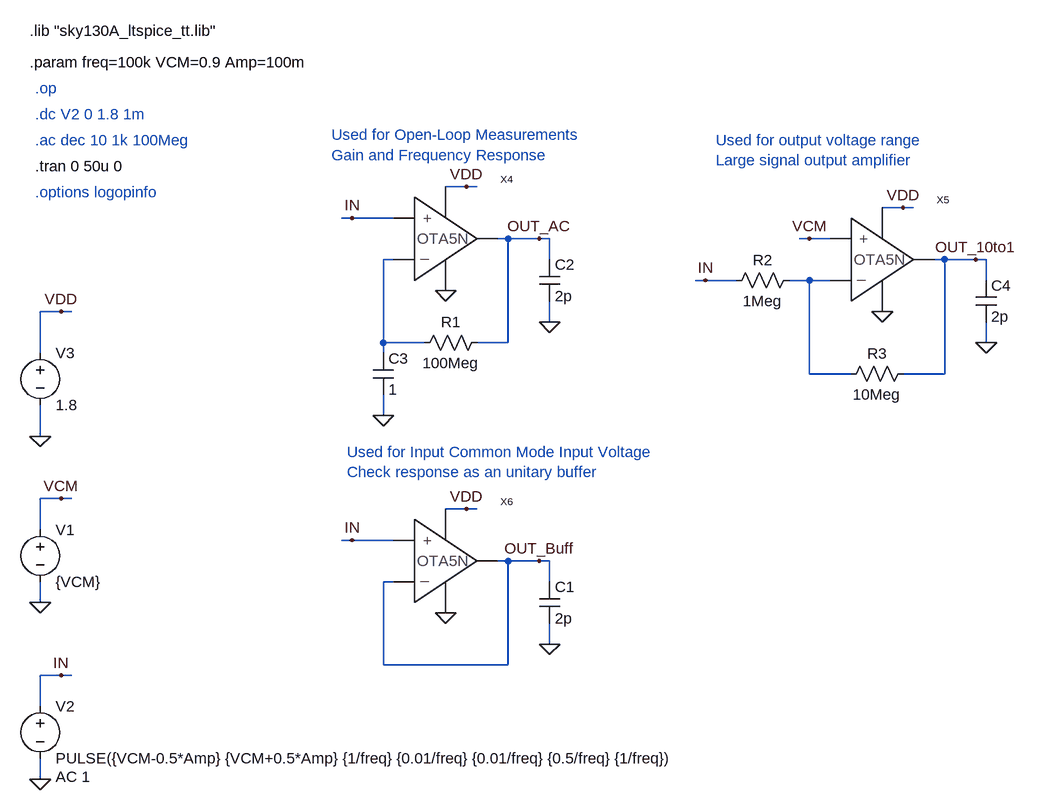
[diagram p0: schematic TB_OTA_Simple.asc]
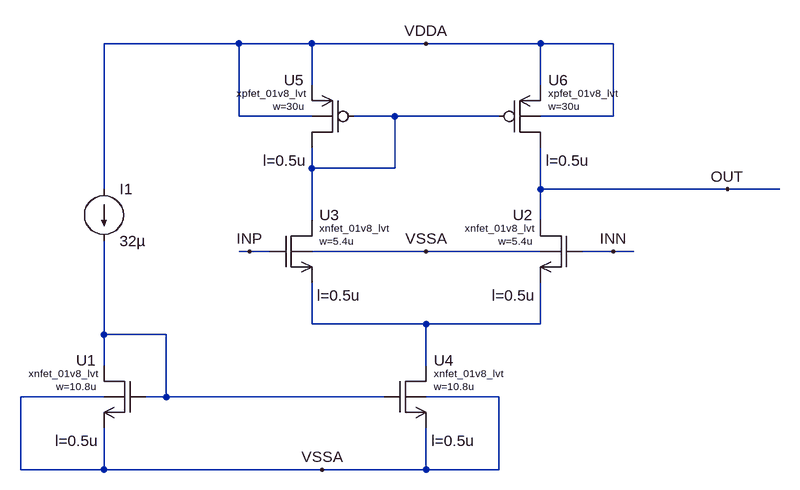
[diagram p1: sub-circuit ota5n_2p_20mhz.asc]
TB_OTA_Simple.asc, the LTspice schematic file:
Version 4.1
SHEET 1 6080 1492
WIRE 800 -224 768 -224
WIRE 816 -224 800 -224
WIRE 1472 -192 1440 -192
WIRE 1488 -192 1472 -192
WIRE 624 -176 608 -176
WIRE 688 -176 624 -176
WIRE 864 -144 848 -144
WIRE 912 -144 864 -144
WIRE 928 -144 912 -144
WIRE 1328 -144 1312 -144
WIRE 1360 -144 1328 -144
WIRE 688 -112 672 -112
WIRE 928 -112 928 -144
WIRE 1536 -112 1520 -112
WIRE 1584 -112 1536 -112
WIRE 1600 -112 1584 -112
WIRE 1168 -80 1152 -80
WIRE 1216 -80 1168 -80
WIRE 1328 -80 1296 -80
WIRE 1360 -80 1328 -80
WIRE 1600 -80 1600 -112
WIRE 176 -32 144 -32
WIRE 192 -32 176 -32
WIRE 928 -16 928 -48
WIRE 672 16 672 -112
WIRE 736 16 672 16
WIRE 864 16 864 -144
WIRE 864 16 816 16
WIRE 1600 16 1600 -16
WIRE 144 32 144 -32
WIRE 672 32 672 16
WIRE 1328 64 1328 -80
WIRE 1392 64 1328 64
WIRE 1536 64 1536 -112
WIRE 1536 64 1472 64
WIRE 672 128 672 96
WIRE 144 160 144 112
WIRE 176 256 144 256
WIRE 192 256 176 256
WIRE 800 272 768 272
WIRE 816 272 800 272
WIRE 144 304 144 256
WIRE 624 320 608 320
WIRE 688 320 624 320
WIRE 864 352 848 352
WIRE 912 352 864 352
WIRE 928 352 912 352
WIRE 688 384 672 384
WIRE 928 384 928 352
WIRE 144 416 144 384
WIRE 928 480 928 448
WIRE 672 512 672 384
WIRE 864 512 864 352
WIRE 864 512 672 512
WIRE 176 528 144 528
WIRE 192 528 176 528
WIRE 144 576 144 528
WIRE 144 688 144 656
FLAG 176 -32 VDD
FLAG 144 160 0
FLAG 144 688 0
FLAG 176 528 IN
FLAG 928 -16 0
FLAG 768 -64 0
FLAG 800 -224 VDD
FLAG 672 128 0
FLAG 624 -176 IN
FLAG 912 -144 OUT_AC
FLAG 928 480 0
FLAG 768 432 0
FLAG 800 272 VDD
FLAG 624 320 IN
FLAG 912 352 OUT_Buff
FLAG 1600 16 0
FLAG 1440 -32 0
FLAG 1472 -192 VDD
FLAG 1584 -112 OUT_10to1
FLAG 144 416 0
FLAG 176 256 VCM
FLAG 1328 -144 VCM
FLAG 1168 -80 IN
SYMBOL voltage 144 16 R0
WINDOW 123 0 0 Left 0
WINDOW 39 0 0 Left 0
SYMATTR InstName V3
SYMATTR Value 1.8
SYMBOL voltage 144 560 R0
WINDOW 123 24 124 Left 2
WINDOW 39 0 0 Left 0
SYMATTR Value2 AC 1
SYMATTR InstName V2
SYMATTR Value PULSE({VCM-0.5*Amp} {VCM+0.5*Amp} {1/freq} {0.01/freq} {0.01/freq} {0.5/freq} {1/freq})
SYMBOL res 832 0 R90
WINDOW 0 0 56 VBottom 2
WINDOW 3 32 56 VTop 2
SYMATTR InstName R1
SYMATTR Value 100Meg
SYMBOL Cap 912 -112 R0
SYMATTR InstName C2
SYMATTR Value 2p
SYMBOL Cap 656 32 R0
SYMATTR InstName C3
SYMATTR Value 1
SYMBOL Cap 912 384 R0
SYMATTR InstName C1
SYMATTR Value 2p
SYMBOL Cap 1584 -80 R0
SYMATTR InstName C4
SYMATTR Value 2p
SYMBOL Res 1312 -96 R90
WINDOW 0 0 56 VBottom 2
WINDOW 3 32 56 VTop 2
SYMATTR InstName R2
SYMATTR Value 1Meg
SYMBOL Res 1488 48 R90
WINDOW 0 0 56 VBottom 2
WINDOW 3 32 56 VTop 2
SYMATTR InstName R3
SYMATTR Value 10Meg
SYMBOL voltage 144 288 R0
WINDOW 123 24 124 Left 2
WINDOW 39 0 0 Left 0
SYMATTR InstName V1
SYMATTR Value {VCM}
SYMBOL OTA5N_2p_20MHz 784 -144 R0
SYMATTR InstName X4
SYMBOL OTA5N_2p_20MHz 1456 -112 R0
SYMATTR InstName X5
SYMBOL OTA5N_2p_20MHz 784 352 R0
SYMATTR InstName X6
TEXT 136 -376 Left 2 ;.op
TEXT 128 -464 Left 2 !.lib "sky130A_ltspice_tt.lib"
TEXT 136 -256 Left 2 !.tran 0 50u 0
TEXT 136 -336 Left 2 ;.dc V2 0 1.8 1m
TEXT 136 -296 Left 2 ;.ac dec 10 1k 100Meg
TEXT 136 -216 Left 2 ;.options logopinfo
TEXT 128 -416 Left 2 !.param freq=100k VCM=0.9 Amp=100m
TEXT 592 -304 Left 2 ;Used for Open-Loop Measurements\nGain and Frequency Response
TEXT 616 184 Left 2 ;Used for Input Common Mode Input Voltage\nCheck response as an unitary buffer
TEXT 1184 -296 Left 2 ;Used for output voltage range\nLarge signal output amplifier

ota5n_2p_20mhz.asc, the sub-circuit schematic file:
Version 4.1
SHEET 1 1108 832
WIRE 144 128 -64 128
WIRE 256 128 144 128
WIRE 432 128 256 128
WIRE 608 128 432 128
WIRE 720 128 608 128
WIRE 256 192 256 128
WIRE 608 192 608 128
WIRE 144 240 144 128
WIRE 256 240 144 240
WIRE 384 240 320 240
WIRE 544 240 384 240
WIRE 720 240 720 128
WIRE 720 240 608 240
WIRE 256 320 256 288
WIRE 384 320 384 240
WIRE 384 320 256 320
WIRE -64 352 -64 128
WIRE 608 352 608 288
WIRE 896 352 608 352
WIRE 976 352 896 352
WIRE 256 400 256 320
WIRE 608 400 608 352
WIRE 160 448 144 448
WIRE 192 448 160 448
WIRE 432 448 256 448
WIRE 608 448 432 448
WIRE 720 448 672 448
WIRE 752 448 720 448
WIRE 256 560 256 496
WIRE 432 560 256 560
WIRE 608 560 608 496
WIRE 608 560 432 560
WIRE -64 576 -64 432
WIRE 32 576 -64 576
WIRE -64 624 -64 576
WIRE 432 624 432 560
WIRE -64 672 -192 672
WIRE 32 672 32 576
WIRE 32 672 0 672
WIRE 368 672 32 672
WIRE 544 672 432 672
WIRE -192 784 -192 672
WIRE -64 784 -64 720
WIRE -64 784 -192 784
WIRE 272 784 -64 784
WIRE 432 784 432 720
WIRE 432 784 272 784
WIRE 544 784 544 672
WIRE 544 784 432 784
FLAG 720 448 INN
FLAG 160 448 INP
FLAG 896 352 OUT
FLAG 432 128 VDDA
FLAG 272 784 VSSA
FLAG 432 448 VSSA
SYMBOL current -64 352 R0
WINDOW 123 0 0 Left 0
WINDOW 39 0 0 Left 0
SYMATTR InstName I1
SYMATTR Value 32µ
SYMBOL xnch -16 624 M0
WINDOW 123 56 116 Left 2
SYMATTR Value2 l=0.5u
SYMATTR InstName U1
SYMATTR Value w=10.8u
SYMATTR SpiceModel xnfet_01v8_lvt
SYMBOL xnch 656 400 M0
WINDOW 123 56 116 Left 2
SYMATTR Value2 l=0.5u
SYMATTR InstName U2
SYMATTR Value w=5.4u
SYMATTR SpiceModel xnfet_01v8_lvt
SYMBOL xnch 208 400 R0
WINDOW 123 56 116 Left 2
SYMATTR Value2 l=0.5u
SYMATTR InstName U3
SYMATTR Value w=5.4u
SYMATTR SpiceModel xnfet_01v8_lvt
SYMBOL xnch 384 624 R0
WINDOW 123 56 116 Left 2
SYMATTR Value2 l=0.5u
SYMATTR InstName U4
SYMATTR Value w=10.8u
SYMATTR SpiceModel xnfet_01v8_lvt
SYMBOL xpch 304 192 M0
WINDOW 123 56 116 Left 2
SYMATTR Value2 l=0.5u
SYMATTR InstName U5
SYMATTR Value w=30u
SYMATTR SpiceModel xpfet_01v8_lvt
SYMBOL xpch 560 192 R0
WINDOW 123 56 116 Left 2
SYMATTR Value2 l=0.5u
SYMATTR InstName U6
SYMATTR Value w=30u
SYMATTR SpiceModel xpfet_01v8_lvt

The netlist it stands for:
* TB_OTA_Simple.asc
V3 VDD 0 1.8
V2 IN 0 PULSE({VCM-0.5*Amp} {VCM+0.5*Amp} {1/freq} {0.01/freq} {0.01/freq} {0.5/freq} {1/freq}) AC 1
R1 OUT_AC N001 100Meg
C2 OUT_AC 0 2p
C3 N001 0 1
C1 OUT_Buff 0 2p
C4 OUT_10to1 0 2p
R2 N002 IN 1Meg
R3 OUT_10to1 N002 10Meg
V1 VCM 0 {VCM}
X§X4 IN N001 OUT_AC VDD 0 ota5n_2p_20mhz
X§X5 VCM N002 OUT_10to1 VDD 0 ota5n_2p_20mhz
X§X6 IN OUT_Buff OUT_Buff VDD 0 ota5n_2p_20mhz

* block symbol definitions
.subckt ota5n_2p_20mhz INP INN OUT VDDA VSSA
I1 VDDA N003 32µ
X§U1 N003 N003 VSSA VSSA xnfet_01v8_lvt w=10.8u l=0.5u  ; pins D G S B
X§U2 OUT INN N002 VSSA xnfet_01v8_lvt w=5.4u l=0.5u  ; pins D G S B
X§U3 N001 INP N002 VSSA xnfet_01v8_lvt w=5.4u l=0.5u  ; pins D G S B
X§U4 N002 N003 VSSA VSSA xnfet_01v8_lvt w=10.8u l=0.5u  ; pins D G S B
X§U5 N001 N001 VDDA VDDA xpfet_01v8_lvt w=30u l=0.5u  ; pins D G S B
X§U6 OUT N001 VDDA VDDA xpfet_01v8_lvt w=30u l=0.5u  ; pins D G S B
.ends ota5n_2p_20mhz

* .op
.lib "sky130A_ltspice_tt.lib"
.tran 0 50u 0
* .dc V2 0 1.8 1m
* .ac dec 10 1k 100Meg
* .options logopinfo
.param freq=100k VCM=0.9 Amp=100m
* Used for Open-Loop Measurements
* Gain and Frequency Response
* Used for Input Common Mode Input Voltage
* Check response as an unitary buffer
* Used for output voltage range
* Large signal output amplifier
.backanno
.end